# EasyEDA Pro project x_terminal.eprj, schematic ESP32 PicoD4 USB直插最小系统开发板
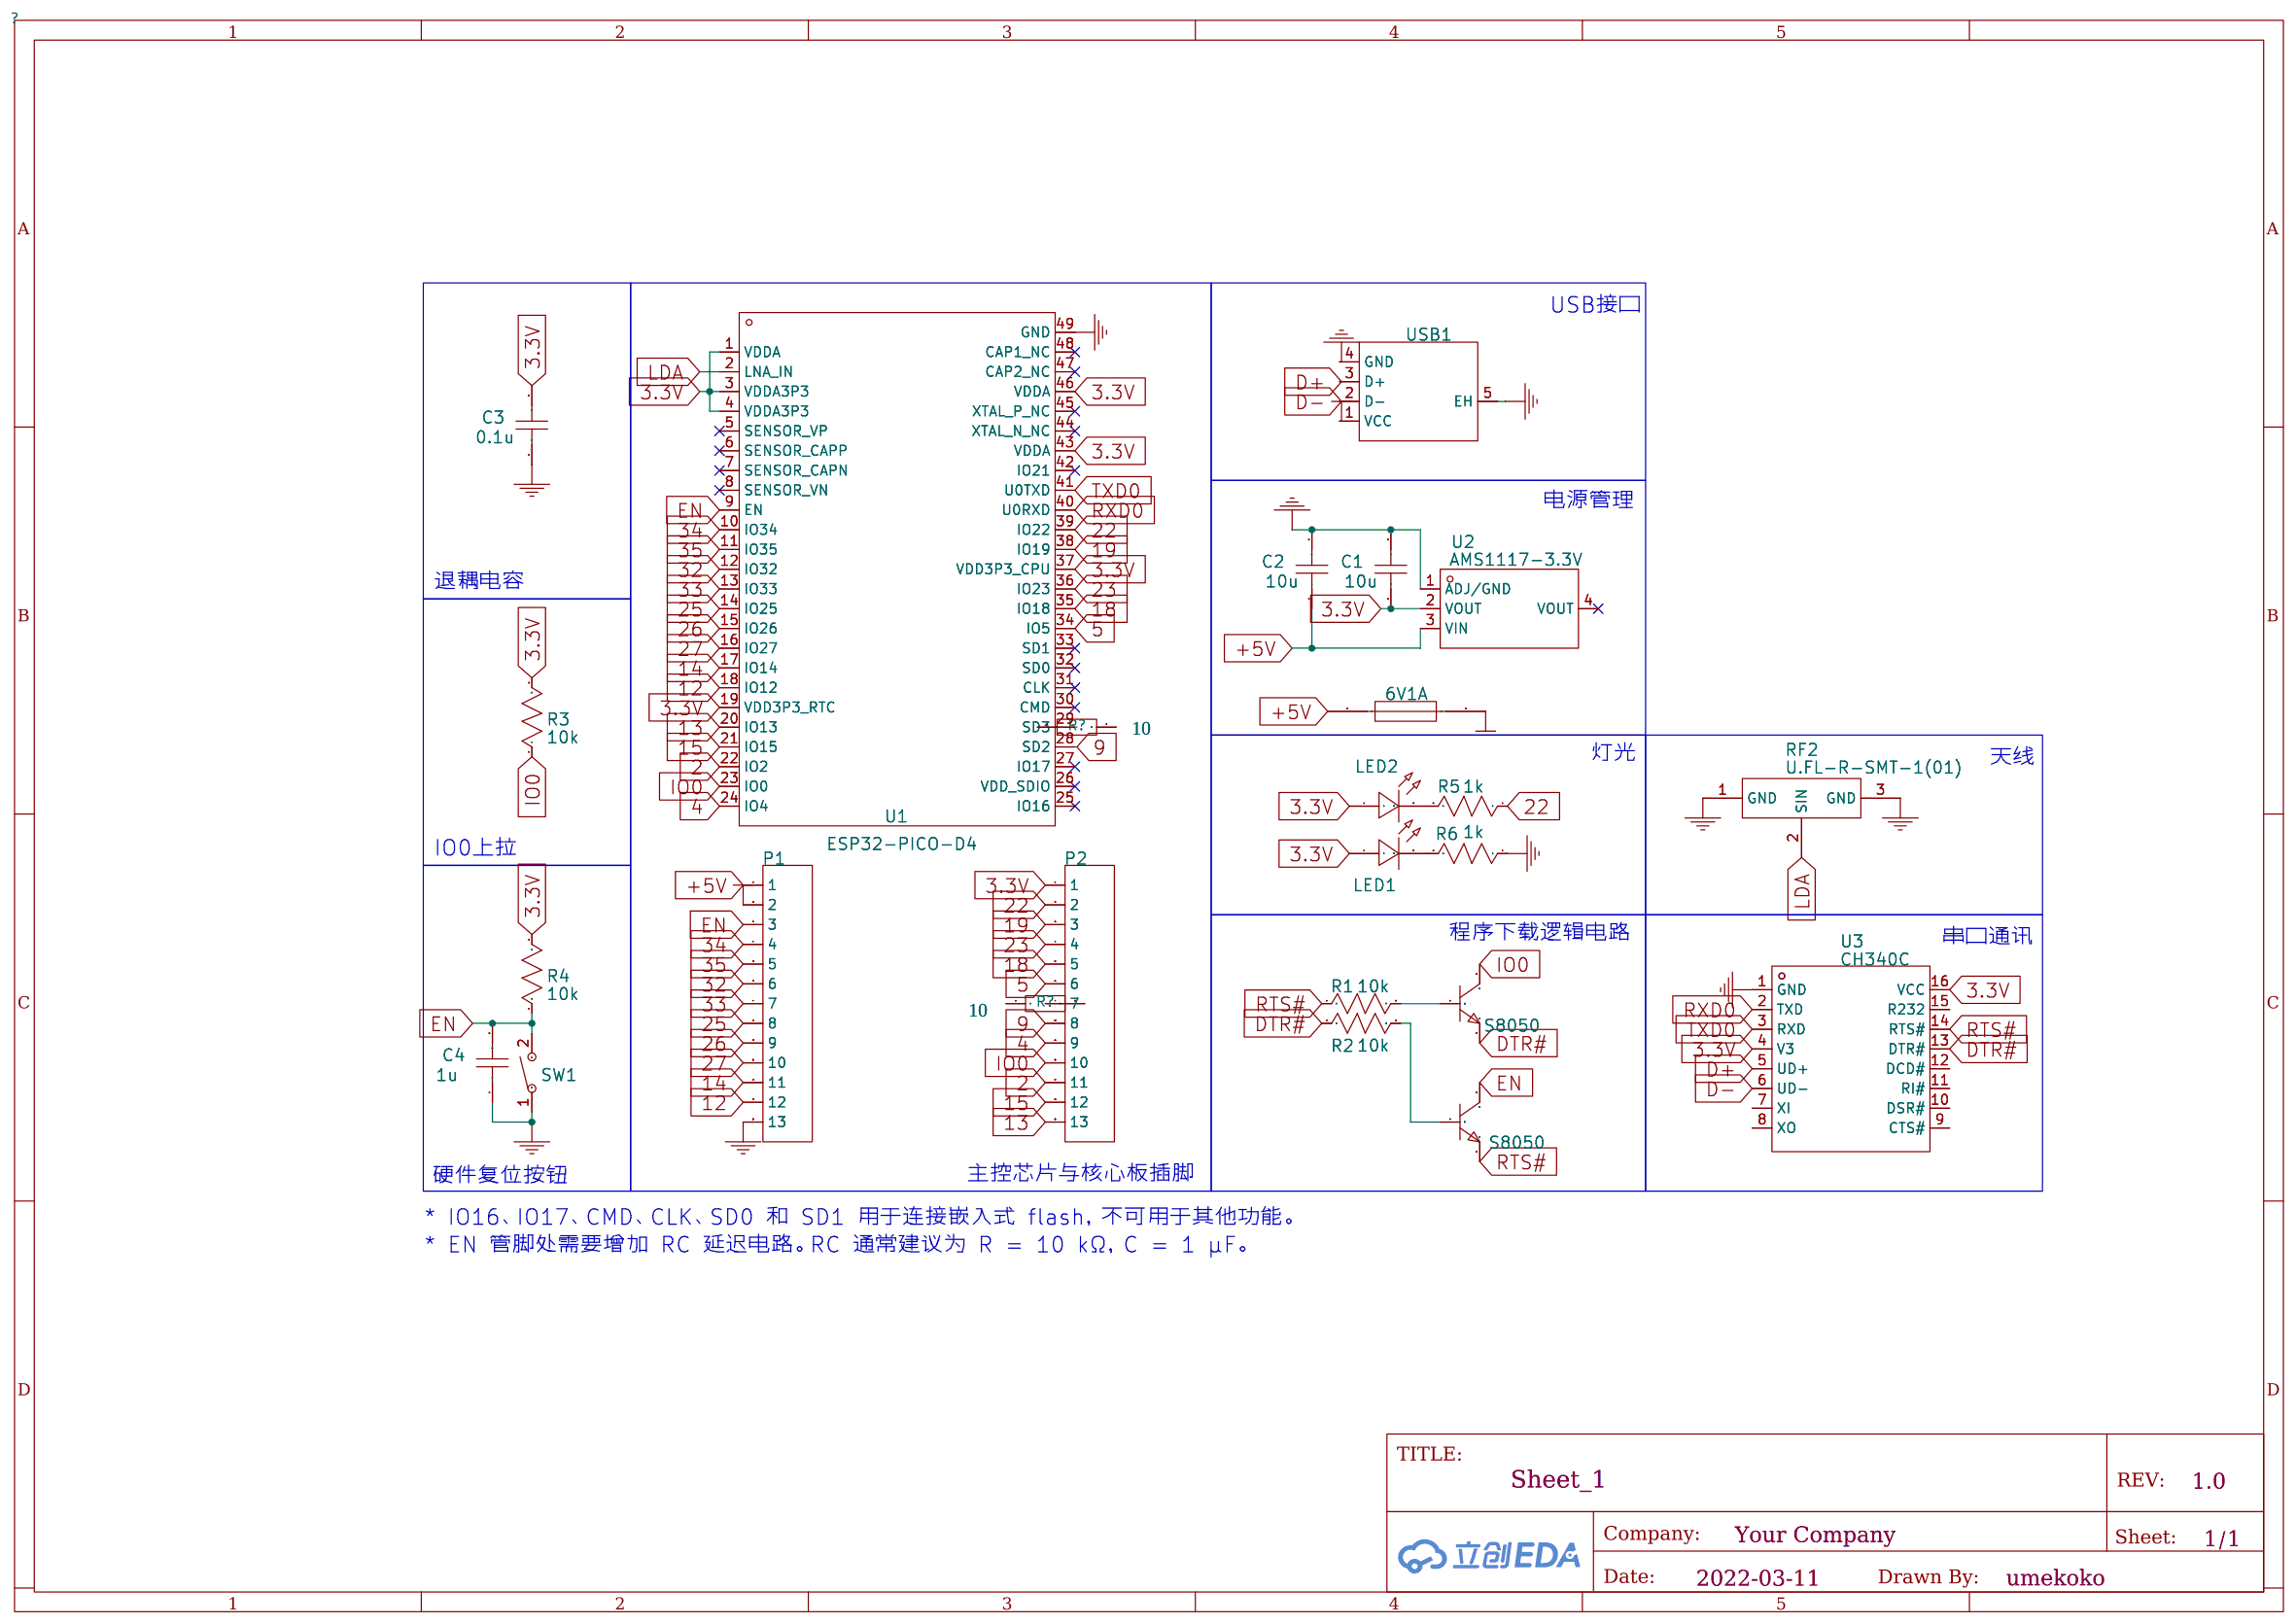
[diagram p1: schematic sheet]

## Parts
C1  10u
C2  10u
C3  0.1u
C4  1u
F6  6V1A
LED1  LED-0603_G
LED2  LED-0603_B
P1  Header-Female-2.54_1x13
P2  Header-Female-2.54_1x13
Q3  S8050
Q4  S8050
R1  10k  [R0603]
R2  10k  [R0603]
R3  10k  [R0603]
R4  10k  [R0603]
R5  1k  [R0603]
R6  1k  [R0603]
R?#1  10  [R0603]
R?#2  10  [R0603]
RF2  U.FL-R-SMT-1(01)
SW1  TS342A2P-WZ
U1  ESP32-PICO-D4
U2  AMS1117-3.3V
U3  CH340C  [SOP-16_L10.0-W3.9-P1.27-LS6.0-BL]
USB1  USB-211-BCW

## Library data of the parts
C1 C2 = 10u
C3 = 0.1u
C4 = 1u
F6 = JK-SMD0603-100L: Supplier: LCSC; Supplier Part: C516069; Manufacturer: Jinrui Electronic Materials Co.; JLCPCB Part Class: Extended Part
LED1 = 19-217/GHC-YR1S2/3T: Manufacturer: EVERLIGHT(台湾亿光); Supplier Part: C72043; Supplier: LCSC
LED2 = 19-217/BHC-ZL1M2RY/3T: Manufacturer: EVERLIGHT(台湾亿光); Supplier Part: C72041; Supplier: LCSC
P1 P2 = Female header 2.54-1*13P: Supplier: LCSC; Manufacturer: BOOMELE; Supplier Part: C52709; JLCPCB Part Class: Extended Part
Q3 Q4 = S8050: Supplier: LCSC; Supplier Part: C908252; Manufacturer: FUXINSEMI; JLCPCB Part Class: Extended Part
R1-R4 = 10K: 3DModel: R0603_L1.6-W0.8-H0.8; link: https://www.mouser.in/datasheet/2/447/PYu_RT_1_to_0_01_RoHS_L_11-1669912.pdf; Supplier: LCSC; Manufacturer: UniOhm; Manufacturer Part: 0603WAF1002T5E; Supplier Part: C25804; JLCPCB Part Class: Basic Part
R5 R6 = 1K: 3DModel: R0603_L1.6-W0.8-H0.8; link: https://www.mouser.in/datasheet/2/447/PYu_RT_1_to_0_01_RoHS_L_11-1669912.pdf; Supplier: LCSC; Manufacturer: UniOhm; Manufacturer Part: 0603WAF1002T5E; Supplier Part: C25804; JLCPCB Part Class: Basic Part
R?#1 R?#2 = 10: 3DModel: R0603_L1.6-W0.8-H0.8; link: https://www.mouser.in/datasheet/2/447/PYu_RT_1_to_0_01_RoHS_L_11-1669912.pdf; Supplier: LCSC; Manufacturer: UniOhm; Manufacturer Part: 0603WAF1002T5E; Supplier Part: C25804; JLCPCB Part Class: Basic Part
RF2 = U.FL-R-SMT-1(01): Supplier: LCSC; Supplier Part: C598199; Manufacturer: HRS(Hirose); JLCPCB Part Class: Extended Part
SW1 = TS342A2P-WZ: Supplier: LCSC; Supplier Part: C557591; Manufacturer: SHOU HAN; JLCPCB Part Class: Extended Part
U1 = ESP32-PICO-D4: Supplier: LCSC; Supplier Part: C193707; Manufacturer: Espressif Systems; JLCPCB Part Class: Extended Part
U2 = AMS1117-3.3V: Supplier: LCSC; Supplier Part: C2688239; Manufacturer: WPMtek(维攀微); JLCPCB Part Class: Extended Part
U3 = CH340C: link: https://item.szlcsc.com/391677.html; Supplier Part: C84681; Supplier: LCSC; Manufacturer: WCH; 3DModel: SOP-16_L9.9-W3.9-H1.5-LS6.0-P1.27; JLCPCB Part Class: Extend
USB1 = USB-211-BCW: Supplier: LCSC; Supplier Part: C720520; Manufacturer: XUNPU; JLCPCB Part Class: Extended Part

## Nets
3.3V: C1.1 C3.2 LED1.1 LED2.1 P2.1 R3.2 R4.2 U1.1(VDDA) U1.3(VDDA3P3) U1.4(VDDA3P3) U1.19(VDD3P3_RTC) U1.37(VDD3P3_CPU) U1.43(VDDA) U1.46(VDDA) U2.2(VOUT) U3.4(V3) U3.16(VCC)
+5V: C2.1 F6.2 P1.1 U2.3(VIN)
GND: C1.2 C2.2 C3.1 C4.1 P1.13 R6.1 RF2.1(GND) RF2.3(GND) SW1.1 U1.49(GND) U2.1(ADJ/GND) U3.1(GND) USB1.4(GND) USB1.5(EH)
VIN: F6.1 P1.2 USB1.1(VCC)
2: P2.11 U1.22(IO2)
4: P2.9 U1.24(IO4)
5: P2.6 U1.34(IO5)
9: P2.8 U1.28(SD2)
10: P2.7 U1.29(SD3)
12: P1.12 U1.18(IO12)
13: P2.13 U1.20(IO13)
14: P1.11 U1.17(IO14)
15: P2.12 U1.21(IO15)
18: P2.5 U1.35(IO18)
19: P2.3 U1.38(IO19)
22: P2.2 R5.1 U1.39(IO22)
23: P2.4 U1.36(IO23)
25: P1.8 U1.14(IO25)
26: P1.9 U1.15(IO26)
27: P1.10 U1.16(IO27)
32: P1.6 U1.12(IO32)
33: P1.7 U1.13(IO33)
34: P1.4 U1.10(IO34)
35: P1.5 U1.11(IO35)
D+: U3.5(UD+) USB1.3(D+)
D-: U3.6(UD-) USB1.2(D-)
DTR#: Q4.2(E) R2.1 U3.13(DTR#)
EN: C4.2 P1.3 Q3.3(C) R4.1 SW1.2 U1.9(EN)
IO0: P2.10 Q4.3(C) R3.1 U1.23(IO0)
LDA: RF2.2(SIN) U1.2(LNA_IN)
RTS#: Q3.2(E) R1.1 U3.14(RTS#)
RXD0: U1.40(U0RXD) U3.2(TXD)
TXD0: U1.41(U0TXD) U3.3(RXD)
Net-(LED1-2): LED1.2 R6.2
Net-(LED2-2): LED2.2 R5.2
Net-(Q3-1): Q3.1(B) R2.2
Net-(Q4-1): Q4.1(B) R1.2

Not connected (* = marked no-connect by the designer): R?#1 1 2; R?#2 1 2; U1 5(SENSOR_VP)* 6(SENSOR_CAPP)* 7(SENSOR_CAPN)* 8(SENSOR_VN)* 25(IO16)* 26(VDD_SDIO)* 27(IO17)* 30(CMD)* 31(CLK)* 32(SD0)* 33(SD1)* 42(IO21)* 44(XTAL_N_NC)* 45(XTAL_P_NC)* 47(CAP2_NC)* 48(CAP1_NC)*; U2 4(VOUT)*; U3 7(XI) 8(XO) 9(CTS#) 10(DSR#) 11(RI#) 12(DCD#) 15(R232)

## Notes on the sheet
- USB接口
- 电源管理
- 退耦电容
- 灯光
- 天线
- IO0上拉
- 程序下载逻辑电路
- 串口通讯
- 硬件复位按钮
- 主控芯片与核心板插脚
- * IO16、IO17、CMD、CLK、SD0 和 SD1 用于连接嵌入式 flash，不可用于其他功能。
- * EN 管脚处需要增加 RC 延迟电路。RC 通常建议为 R = 10 kΩ，C = 1 µF。
